# EAGLE design Shruti-FrontPanel-v03 (EAGLE 5.06)
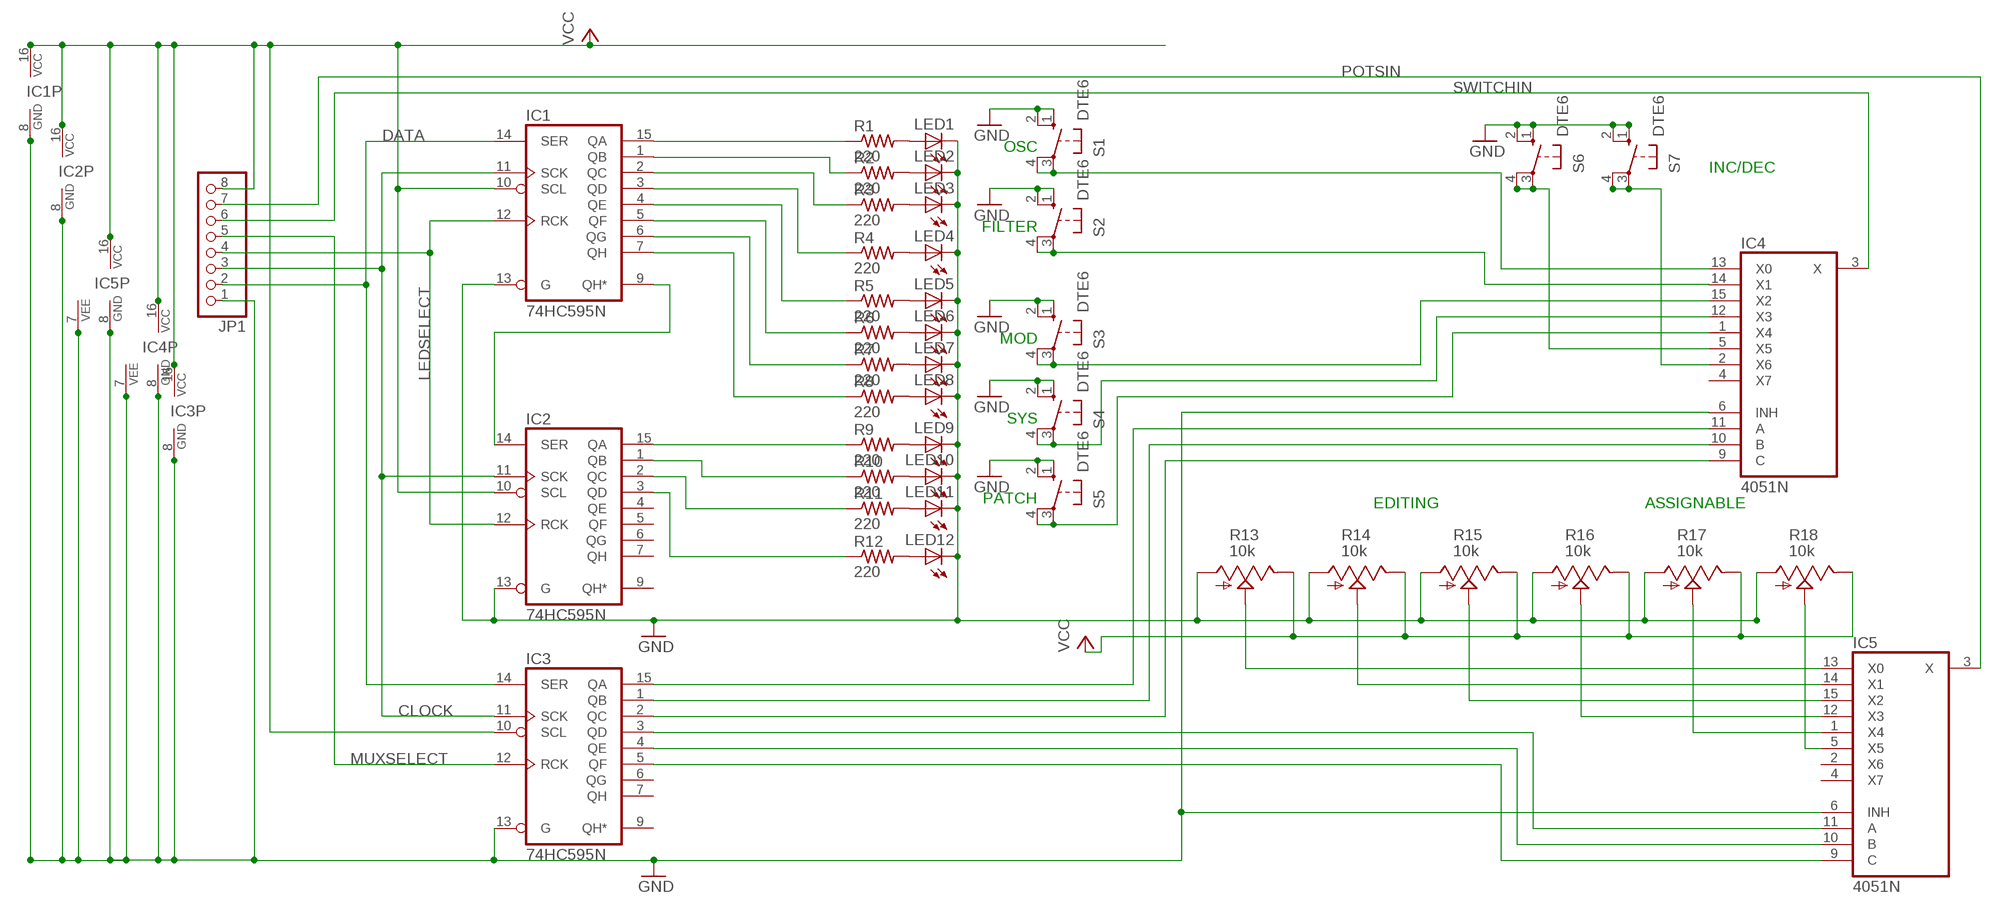
[diagram p0: schematic, sheet 1]

## Parts
IC1  74HC595N  [DIL16]
IC2  74HC595N  [DIL16]
IC3  74HC595N  [DIL16]
IC4  4051N  [DIL16]
IC5  4051N  [DIL16]
JP1  PINHD-1X8  [1X08]
LED1  LED3MM  [LED3MM]
LED2  LED3MM  [LED3MM]
LED3  LED3MM  [LED3MM]
LED4  LED3MM  [LED3MM]
LED5  LED3MM  [LED3MM]
LED6  LED3MM  [LED3MM]
LED7  LED3MM  [LED3MM]
LED8  LED3MM  [LED3MM]
LED9  LED3MM  [LED3MM]
LED10  LED3MM  [LED3MM]
LED11  LED3MM  [LED3MM]
LED12  LED3MM  [LED3MM]
R1  220  R-US_0204/7  [0204/7]
R2  220  R-US_0204/7  [0204/7]
R3  220  R-US_0204/7  [0204/7]
R4  220  R-US_0204/7  [0204/7]
R5  220  R-US_0204/7  [0204/7]
R6  220  R-US_0204/7  [0204/7]
R7  220  R-US_0204/7  [0204/7]
R8  220  R-US_0204/7  [0204/7]
R9  220  R-US_0204/7  [0204/7]
R10  220  R-US_0204/7  [0204/7]
R11  220  R-US_0204/7  [0204/7]
R12  220  R-US_0204/7  [0204/7]
R13  10k  POT_US  [ALPS_POT_SFE]
R14  10k  POT_US  [ALPS_POT_SFE]
R15  10k  POT_US  [ALPS_POT_SFE]
R16  10k  POT_US  [ALPS_POT_SFE]
R17  10k  POT_US  [ALPS_POT_SFE]
R18  10k  POT_US  [ALPS_POT_SFE]
S1  DTE6  40-XX  [B3F-40XX]
S2  DTE6  40-XX  [B3F-40XX]
S3  DTE6  40-XX  [B3F-40XX]
S4  DTE6  40-XX  [B3F-40XX]
S5  DTE6  40-XX  [B3F-40XX]
S6  DTE6  40-XX  [B3F-40XX]
S7  DTE6  40-XX  [B3F-40XX]

## Nets
CLOCK: IC1.11(SCK) IC2.11(SCK) IC3.11(SCK) JP1.3
DATA: IC1.14(SER) IC3.14(SER) JP1.2
GND: IC1.8(GND) IC1.13(G) IC2.8(GND) IC2.13(G) IC3.8(GND) IC3.13(G) IC4.6(INH) IC4.7(VEE) IC4.8(GND) IC5.6(INH) IC5.7(VEE) IC5.8(GND) JP1.1 LED1.K(C) LED2.K(C) LED3.K(C) LED4.K(C) LED5.K(C) LED6.K(C) LED7.K(C) LED8.K(C) LED9.K(C) LED10.K(C) LED11.K(C) LED12.K(C) R13.P$3(A) R14.P$3(A) R15.P$3(A) R16.P$3(A) R17.P$3(A) R18.P$3(A) S1.1(S) S1.2(S1) S2.1(S) S2.2(S1) S3.1(S) S3.2(S1) S4.1(S) S4.2(S1) S5.1(S) S5.2(S1) S6.1(S) S6.2(S1) S7.1(S) S7.2(S1)
LEDSELECT: IC1.12(RCK) IC2.12(RCK) JP1.4
MUXSELECT: IC3.12(RCK) JP1.5
N$1: IC1.9(QH*) IC2.14(SER)
N$2: LED1.A R1.2
N$3: LED2.A R2.2
N$4: LED3.A R3.2
N$5: LED4.A R4.2
N$6: LED5.A R5.2
N$7: LED6.A R6.2
N$8: LED7.A R7.2
N$9: LED9.A R9.2
N$10: LED10.A R10.2
N$11: LED11.A R11.2
N$12: LED12.A R12.2
N$13: IC1.15(QA) R1.1
N$14: IC1.1(QB) R2.1
N$15: IC1.2(QC) R3.1
N$16: IC1.3(QD) R4.1
N$17: IC1.4(QE) R5.1
N$18: IC1.5(QF) R6.1
N$19: IC1.6(QG) R7.1
N$20: IC1.7(QH) R8.1
N$21: LED8.A R8.2
N$22: IC2.15(QA) R9.1
N$23: IC2.1(QB) R10.1
N$24: IC2.2(QC) R11.1
N$25: IC3.15(QA) IC4.11(A)
N$26: IC3.1(QB) IC4.10(B)
N$27: IC2.3(QD) R12.1
N$28: IC5.1(X4) R17.P$2(S)
N$29: IC5.5(X5) R18.P$2(S)
N$31: IC3.2(QC) IC4.9(C)
N$32: IC3.3(QD) IC5.11(A)
N$33: IC3.4(QE) IC5.10(B)
N$34: IC3.5(QF) IC5.9(C)
N$35: IC5.13(X0) R13.P$2(S)
N$36: IC4.5(X5) S6.3(P) S6.4(P1)
N$37: IC5.14(X1) R14.P$2(S)
N$38: IC5.15(X2) R15.P$2(S)
N$39: IC5.12(X3) R16.P$2(S)
N$40: IC4.2(X6) S7.3(P) S7.4(P1)
N$41: IC4.13(X0) S1.3(P) S1.4(P1)
N$42: IC4.14(X1) S2.3(P) S2.4(P1)
N$43: IC4.15(X2) S3.3(P) S3.4(P1)
N$44: IC4.12(X3) S4.3(P) S4.4(P1)
N$45: IC4.1(X4) S5.3(P) S5.4(P1)
POTSIN: IC5.3(X) JP1.7
SWITCHIN: IC4.3(X) JP1.6
VCC: IC1.10(SCL) IC1.16(VCC) IC2.10(SCL) IC2.16(VCC) IC3.10(SCL) IC3.16(VCC) IC4.16(VCC) IC5.16(VCC) JP1.8 R13.P$1(E) R14.P$1(E) R15.P$1(E) R16.P$1(E) R17.P$1(E) R18.P$1(E)
Unconnected: IC2.4(QE) IC2.5(QF) IC2.6(QG) IC2.7(QH) IC2.9(QH*) IC3.6(QG) IC3.7(QH) IC3.9(QH*) IC4.4(X7) IC5.2(X6) IC5.4(X7)

## Notes on the sheet
- OSC
- INC/DEC
- FILTER
- MOD
- SYS
- PATCH
- EDITING | ASSIGNABLE

## Library data of the parts
IC1-IC3 = 74xx-eu:74*595: 8-bit SHIFT REGISTER, output latch
IC4 IC5 = 40xx:4051: 8-channel ANALOG MULTIPLEXER
JP1 = pinhead:PINHD-1X8: PIN HEADER
LED1-LED12 = led:LED: LED OSRAM: - CHIPLED LG R971, LG N971, LY N971, LG Q971, LY Q971, LO R971, LY R971 LH N974, LH R974 LS Q976, LO Q976, LY Q976 LO Q996 - Hyper CHIPLED LW Q18S LB Q993, LB Q99A, LB R99A - SideLED LS A670, LO A670, LY A670, LG A670, LP A670 LB A673, LV A673, LT A673, LW A673 LH A674 LY A675 LS A676, LA A676, LO A676, LY A676, LW A676 LS A679, LY A679, LG A679 - Hyper Micro SIDELED® LS Y876, LA Y876, LO Y876, LY Y876 LT Y87S - SmartLED LW L88C, LW L88S LB L89C, LB L89S, LG L890 LS L89K, LO L89K, LY L89K LS L896, LA L896, LO L896, LY L896 - TOPLED LS T670, LO T670, LY T670, LG T670, LP T670 LSG T670, LSP T670, LSY T670, LOP T670, LYG T670 LG T671, LOG T671, LSG T671 LB T673, LV T673, LT T673, LW T673 LH T674 LS T676, LA T676, LO T676, LY T676, LB T676, LH T676, LSB T676, LW T676 LB T67C, LV T67C, LT T67C, LS T67K, LO T67K, LY T67K, LW E67C LS E67B, LA E67B, LO E67B, LY E67B, LB E67C, LV E67C, LT E67C LW T67C LS T679, LY T679, LG T679 LS T770, LO T770, LY T770, LG T770, LP T770 LB T773, LV T773, LT T773, LW T773 LH T774 LS E675, LA E675, LY E675, LS T675 LS T776, LA T776, LO T776, LY T776, LB T776 LHGB T686 LT T68C, LB T68C - Hyper Mini TOPLED® LB M676 - Mini TOPLED Santana® LG M470 LS M47K, LO M47K, LY M47K Source: http://www.osram.convergy.de LUXEON: - LUMILED® LXK2-PW12-R00, LXK2-PW12-S00, LXK2-PW14-U00, LXK2-PW14-V00 LXK2-PM12-R00, LXK2-PM12-S00, LXK2-PM14-U00 LXK2-PE12-Q00, LXK2-PE12-R00, LXK2-PE12-S00, LXK2-PE14-T00, LXK2-PE14-U00 LXK2-PB12-K00, LXK2-PB12-L00, LXK2-PB12-M00, LXK2-PB14-N00, LXK2-PB14-P00, LXK2-PB14-Q00 LXK2-PR12-L00, LXK2-PR12-M00, LXK2-PR14-Q00, LXK2-PR14-R00 LXK2-PD12-Q00, LXK2-PD12-R00, LXK2-PD12-S00 LXK2-PH12-R00, LXK2-PH12-S00 LXK2-PL12-P00, LXK2-PL12-Q00, LXK2-PL12-R00 Source: www.luxeon.com KINGBRIGHT: KA-3528ASYC Source: www.kingbright.com
R1-R12 = resistor:R-US_: RESISTOR, American symbol
R13-R18 = pot-alps:POT_US
S1-S7 = switch-omron:40-XX: OMRON SWITCH

## Board
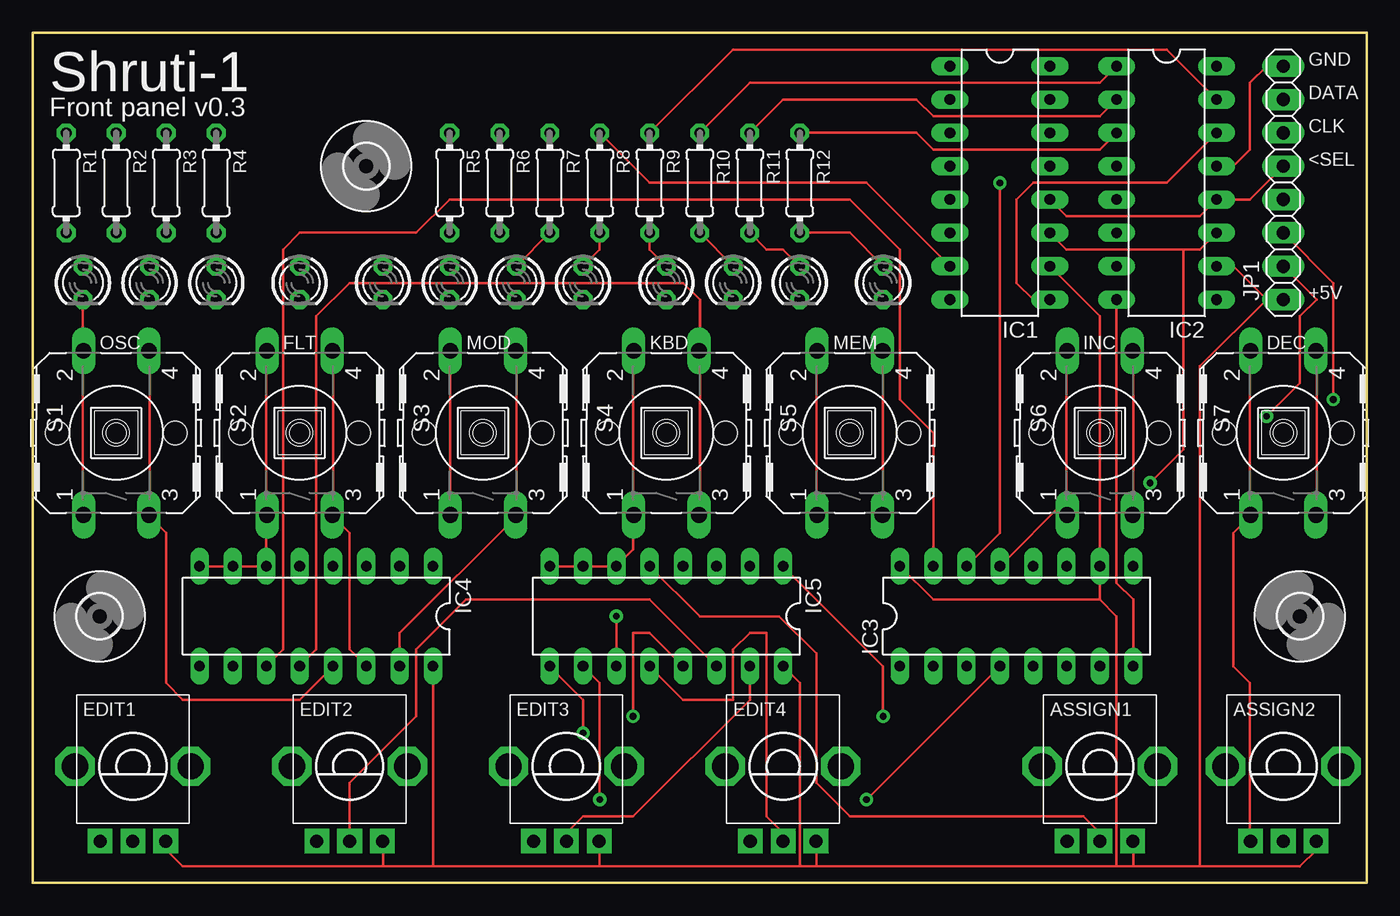
[diagram p1: board, top side]
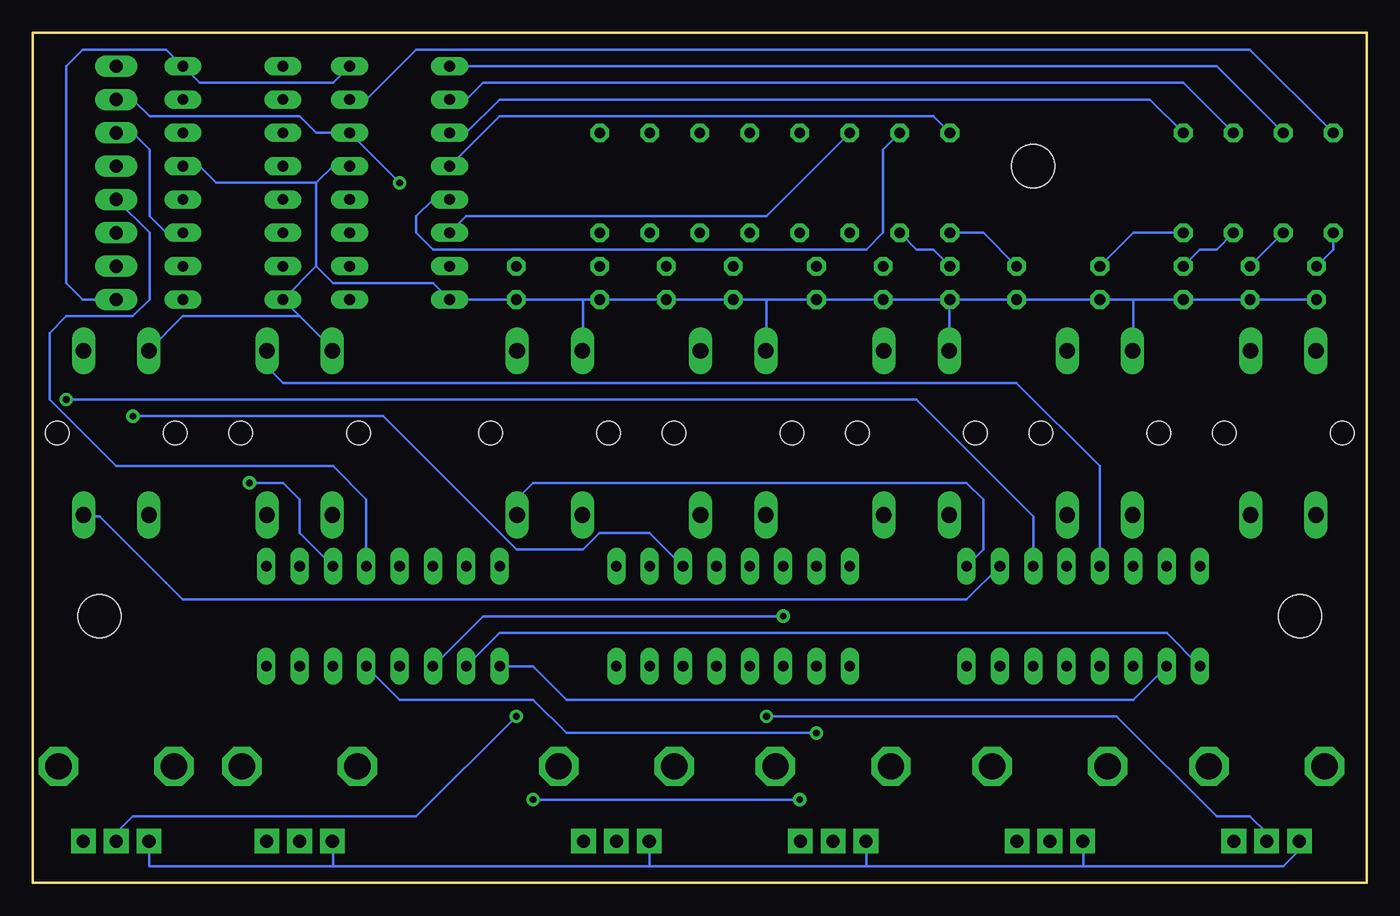
[diagram p2: board, bottom side, seen from below]

Size 101.6 x 64.77 mm. Coordinates in mm from the lower left corner, seen from the top.
Outline: 0,64.76 101.6,64.76 101.6,0 0,0 0,64.76
Outline: 0,64.77 0,64.76
Copper layers (1*16): Top 0.035mm / dielectric 1.5mm / Bottom 0.035mm
Design rules "SparkFun": minimum track width 8mil, minimum drill 20mil, track to track 8mil, track to pad 8mil, pad to pad 8mil, via to via 8mil, smd to smd 8mil, copper to edge 10mil, drill to drill 8mil, minimum pad ring 12mil, minimum via ring 10mil, stop-mask expansion 4mil, vias tented up to drill 25mil, thermal gap 10mil

### Footprints (pad centres in the part's own frame; a part is rotated, then mirrored left to right if it is on the bottom)
DIL16 = drill 0.813 long: 1 -8.89,-3.81; 2 -6.35,-3.81; 3 -3.81,-3.81; 4 -1.27,-3.81; 5 1.27,-3.81; 6 3.81,-3.81; 7 6.35,-3.81; 8 8.89,-3.81; 9 8.89,3.81; 10 6.35,3.81; 11 3.81,3.81; 12 1.27,3.81; 13 -1.27,3.81; 14 -3.81,3.81; 15 -6.35,3.81; 16 -8.89,3.81
1X08 = drill 1.016 long: 1 -8.89,0; 2 -6.35,0; 3 -3.81,0; 4 -1.27,0; 5 1.27,0; 6 3.81,0; 7 6.35,0; 8 8.89,0
LED3MM = drill 0.813 octagon: A -1.27,0; K 1.27,0
0204/7 = drill 0.813 octagon: 1 -3.81,0; 2 3.81,0
ALPS_POT_SFE = drill 1 pad 1.88 square: P$1 -2.5,5.7; P$2 0,5.7; P$3 2.5,5.7 | drill 2 octagon: P$4 -4.4,0; P$5 4.4,0
B3F-40XX = drill 1.194 long: 1 -6.248,2.489; 2 6.248,2.489; 3 -6.248,-2.489; 4 6.248,-2.489 | hole 1.803: 0,-4.496; 0,4.496
3,3 = hole 3.3: 0,0

### Placement (x,y rotation side)
IC1  73.66,53.34 270 top
IC2  86.36,53.34 270 top
IC3  74.93,20.32 0 top
IC4  21.59,20.32 180 top
IC5  48.26,20.32 180 top
JP1  95.25,53.34 270 top
LED1  3.81,45.72 270 top
LED2  8.89,45.72 270 top
LED3  13.97,45.72 270 top
LED4  20.32,45.72 270 top
LED5  26.67,45.72 270 top
LED6  31.75,45.72 270 top
LED7  36.83,45.72 270 top
LED8  41.91,45.72 270 top
LED9  48.26,45.72 270 top
LED10  53.34,45.72 270 top
LED11  58.42,45.72 270 top
LED12  64.77,45.72 270 top
R1  2.54,53.34 270 top
R2  6.35,53.34 270 top
R3  10.16,53.34 270 top
R4  13.97,53.34 270 top
R5  31.75,53.34 270 top
R6  35.56,53.34 270 top
R7  39.37,53.34 270 top
R8  43.18,53.34 270 top
R9  46.99,53.34 270 top
R10  50.8,53.34 270 top
R11  54.61,53.34 270 top
R12  58.42,53.34 270 top
R13  7.62,8.89 180 top
R14  24.13,8.89 180 top
R15  40.64,8.89 180 top
R16  57.15,8.89 180 top
R17  95.25,8.89 180 top
R18  81.28,8.89 180 top
S1  6.35,34.29 90 top
S2  20.32,34.29 90 top
S3  34.29,34.29 90 top
S4  48.26,34.29 90 top
S5  62.23,34.29 90 top
S6  81.28,34.29 90 top
S7  95.25,34.29 90 top
U$1  [3,3]  5.08,20.32 0 top
U$2  [3,3]  96.52,20.32 90 top
U$3  [3,3]  25.4,54.61 0 top

### Tracks (layer width: path | path; a pad name or v marks a point on that pad's centre or on a via)
CLOCK  (via drill 0.51)
  Top 0.203: 87.63,48.26 88.9,48.26 IC2.11 | 87.63,48.26 78.74,48.26 IC1.11 | v85.09,30.48 87.63,33.02 87.63,48.26
  Bottom 0.203: JP1.3 93.98,57.15 92.71,55.88 92.71,50.8 91.44,49.53 IC2.11 | IC3.11 81.28,26.67 81.28,29.21 82.55,30.48 v85.09,30.48
DATA  (via drill 0.51)
  Top 0.203: IC3.14 73.66,26.67 v73.66,53.34
  Bottom 0.203: JP1.2 93.98,59.69 92.71,58.42 81.28,58.42 80.01,57.15 IC1.14 v73.66,53.34
GND
  Top 0.203: S7.2 92.71,39.37 92.71,29.21 S7.1 92.71,27.94 91.44,26.67 91.44,16.51 92.71,15.24 92.71,3.81 R17.P$3 | S5.1 59.69,29.21 59.69,39.37 S5.2 | S1.1 3.81,29.21 3.81,39.37 S1.2 3.81,40.64 LED1.K | 78.74,29.21 78.74,39.37 S6.2 | S4.2 45.72,39.37 45.72,29.21 S4.1 45.72,27.94 45.72,25.4 IC5.6 IC5.7 IC5.8 | S2.2 17.78,39.37 17.78,29.21 S2.1 17.78,27.94 IC4.6 IC4.7 IC4.8 | 78.74,29.21 IC3.13 | 78.74,29.21 S6.1 | IC3.8 83.82,21.59 82.55,22.86 IC2.8 | IC2.13 91.44,54.61 92.71,55.88 92.71,60.96 93.98,62.23 JP1.1 | S3.2 S3.1
  Bottom 0.203: LED6.K LED5.K LED4.K 17.78,44.45 | LED6.K 31.8,44.4 S3.2 | LED6.K LED7.K LED8.K 45.72,44.45 | 3.86,44.4 LED1.K LED2.K LED3.K 17.78,44.45 | 80.01,46.99 IC2.8 81.28,43.18 | 80.01,46.99 80.01,53.34 | 80.01,53.34 78.74,54.61 IC1.13 | IC2.13 88.9,54.61 87.63,53.34 80.01,53.34 | 45.72,44.45 LED9.K LED10.K LED11.K 59.69,44.45 | 59.69,44.45 LED12.K IC1.8 71.12,45.72 78.74,45.72 80.01,46.99 | 17.78,44.45 17.83,44.45 | 45.72,44.45 45.77,44.45 | 59.69,44.45 59.74,44.45 | 17.78,44.45 17.78,40.64 S2.2 | 45.72,44.45 45.72,40.64 S4.2 | 59.69,44.45 59.69,40.64 S5.2 | S7.1 92.71,27.94 | S6.1 78.74,27.94 | R13.P$3 5.08,3.15 5.08,2.54 6.35,1.27 21.59,1.27 | 21.59,1.27 38.1,1.27 | 38.1,1.27 54.61,1.27 | 54.61,1.27 78.74,1.27 | 78.74,1.27 92.71,1.27 92.75,1.31 R17.P$3 | R18.P$3 78.74,3.15 78.74,1.27 | R16.P$3 54.61,3.15 54.61,1.27 | R15.P$3 38.1,3.15 38.1,1.27 | R14.P$3 21.59,3.15 21.59,1.27 | 81.28,43.18 78.74,40.64 S6.2 | 81.28,43.18 90.17,43.18 92.71,40.64 S7.2
LEDSELECT
  Top 0.203: IC1.12 78.74,50.8 88.9,50.8 IC2.12 92.71,52.07 JP1.4
MUXSELECT
  Bottom 0.203: IC3.12 76.2,29.21 78.74,31.75 95.25,31.75 100.33,36.83 100.33,41.91 99.06,43.18 93.98,43.18 92.71,44.45 92.71,49.53 JP1.5
N$1
  Top 0.203: IC1.9 76.2,44.45 74.93,45.72 74.93,52.07 76.2,53.34 86.36,53.34 IC2.14
N$2
  Bottom 0.203: R1.2 2.54,48.26 LED1.A
N$3
  Bottom 0.203: R2.2 LED2.A
N$4
  Bottom 0.203: R3.2 11.43,48.26 12.7,48.26 LED3.A
N$5
  Bottom 0.203: R4.2 17.78,49.53 LED4.A
N$6
  Bottom 0.203: R5.2 29.21,49.53 LED5.A
N$7
  Bottom 0.203: LED6.A 33.02,48.26 34.29,48.26 R6.2
N$8
  Top 0.203: LED7.A R7.2
N$9
  Top 0.203: R9.2 46.99,48.26 LED9.A
N$10
  Top 0.203: R10.2 LED10.A
N$11
  Top 0.203: R11.2 55.88,48.26 57.15,48.26 LED11.A
N$12
  Top 0.203: R12.2 62.23,49.53 LED12.A
N$13
  Bottom 0.203: IC1.15 76.2,59.69 72.39,63.5 8.89,63.5 R1.1
N$14
  Bottom 0.203: IC1.1 11.43,62.23 R2.1
N$15
  Bottom 0.203: IC1.2 68.58,59.69 67.31,60.96 13.97,60.96 R3.1
N$16
  Bottom 0.203: IC1.3 68.58,57.15 66.04,59.69 16.51,59.69 R4.1
N$17
  Bottom 0.203: R5.1 33.02,58.42 66.04,58.42 IC1.4
N$18
  Bottom 0.203: R6.1 36.83,55.88 36.83,49.53 38.1,48.26 71.12,48.26 72.39,49.53 72.39,50.8 71.12,52.07 IC1.5
N$19
  Bottom 0.203: IC1.6 68.58,50.8 45.72,50.8 R7.1
N$20
  Top 0.203: IC1.7 63.5,53.34 46.99,53.34 R8.1
N$21
  Top 0.203: LED8.A 43.18,48.26 R8.2
N$22
  Top 0.203: R9.1 53.34,63.5 86.36,63.5 IC2.15
N$23
  Top 0.203: R10.1 54.61,60.96 81.28,60.96 IC2.1
N$24
  Top 0.203: R11.1 57.15,59.69 67.31,59.69 68.58,58.42 81.28,58.42 IC2.2
N$25
  Top 0.203: IC4.11 19.05,17.78 19.05,48.26 20.32,49.53 29.21,49.53 31.75,52.07 62.23,52.07 66.04,48.26 66.04,36.83 68.58,34.29 IC3.15
N$26
  Bottom 0.203: IC4.10 17.78,13.97 60.96,13.97 63.5,16.51 IC3.1
N$27
  Top 0.203: R12.1 67.31,57.15 68.58,55.88 81.28,55.88 IC2.3
N$28  (via drill 0.51)
  Top 0.203: IC5.1 64.77,16.51 v64.77,12.7
  Bottom 0.203: v64.77,12.7 72.39,5.08 93.98,5.08 95.25,3.81 R17.P$2
N$29
  Top 0.203: IC5.5 50.8,20.32 56.85,20.32 59.69,17.48 59.69,7.62 62.23,5.08 80.01,5.08 81.28,3.81 R18.P$2
N$31
  Bottom 0.203: IC4.9 15.24,19.05 66.04,19.05 IC3.2
N$32  (via drill 0.51)
  Top 0.203: IC5.11 v44.45,20.32
  Bottom 0.203: v44.45,20.32 67.31,20.32 IC3.3
N$33  (via drill 0.51)
  Top 0.203: IC5.10 43.18,15.24 v43.18,6.35 | v63.5,6.35 IC3.4
  Bottom 0.203: v43.18,6.35 v63.5,6.35
N$34  (via drill 0.51)
  Top 0.203: IC5.9 41.91,13.97 v41.91,11.43
  Bottom 0.203: v41.91,11.43 60.96,11.43 63.5,13.97 73.66,13.97 IC3.5
N$35  (via drill 0.51)
  Top 0.203: IC5.13 46.99,19.05 45.72,19.05 v45.72,12.7
  Bottom 0.203: v45.72,12.7 19.05,12.7 11.43,5.08 8.89,5.08 7.62,3.81 R13.P$2
N$36
  Top 0.203: S6.3 83.82,29.21 83.82,39.37 S6.4
  Bottom 0.203: IC4.5 20.32,31.75 26.67,38.1 82.55,38.1 83.82,39.37 S6.4
N$37
  Top 0.203: IC5.14 46.99,21.59 33.02,21.59 29.21,17.78 29.21,12.7 24.13,7.62 R14.P$2
N$38
  Top 0.203: IC5.15 54.61,13.97 45.72,5.08 41.91,5.08 40.64,3.81 R15.P$2
N$39
  Top 0.203: IC5.12 49.53,13.97 53.34,13.97 53.34,17.78 54.61,19.05 55.88,19.05 55.88,5.08 57.15,3.81 R16.P$2
N$40
  Top 0.203: S7.4 97.79,39.37 97.79,29.21 S7.3
  Bottom 0.203: IC4.2 30.48,21.59 90.17,21.59 91.44,22.86 96.52,27.94 97.79,27.94 S7.3
N$41
  Top 0.203: S1.4 8.89,39.37 8.89,29.21 S1.3 8.89,27.94 10.16,26.67 10.16,15.24 11.43,13.97 20.32,13.97 IC4.13
N$42
  Top 0.203: S2.4 22.86,39.37 22.86,29.21 S2.3 22.86,27.94 24.13,26.67 24.13,17.78 IC4.14
N$43
  Top 0.203: S3.4 36.83,39.37 36.83,29.21 S3.3 36.83,27.94 27.94,19.05 IC4.15
N$44
  Top 0.203: S4.3 50.8,29.21 50.8,39.37 S4.4 50.8,40.64 50.8,44.45 49.53,45.72 24.13,45.72 21.59,43.18 21.59,17.78 IC4.12
N$45
  Top 0.203: S5.4 64.77,39.37 64.77,29.21 S5.3
  Bottom 0.203: 64.77,27.94 S5.3 64.77,29.21 63.5,30.48 30.48,30.48 29.21,29.21 29.21,25.4 IC4.1
POTSIN  (via drill 0.51)
  Top 0.203: v93.98,35.56 96.52,38.1 96.52,43.18 97.79,44.45 JP1.7
  Bottom 0.203: IC5.3 54.61,26.67 58.42,26.67 59.69,25.4 64.77,25.4 74.93,35.56 v93.98,35.56
SWITCHIN  (via drill 0.51)
  Top 0.203: v99.06,36.83 99.06,45.72 JP1.6
  Bottom 0.203: IC4.3 25.4,27.94 34.29,36.83 v99.06,36.83
VCC
  Top 0.203: 93.98,44.45 91.44,46.99 IC2.10 | R13.P$1 10.16,3.15 10.16,2.54 11.43,1.27 26.67,1.27 | 26.67,1.27 30.48,1.27 | 30.48,1.27 43.18,1.27 | 43.18,1.27 58.42,1.27 | 58.42,1.27 59.69,1.27 | 59.69,1.27 82.55,1.27 | 82.55,1.27 83.82,1.27 | 83.82,1.27 88.9,1.27 | 88.9,1.27 96.52,1.27 97.79,2.54 R17.P$1 | R18.P$1 83.82,3.15 83.82,1.27 | R16.P$1 59.69,3.15 59.69,1.27 | R15.P$1 43.18,3.15 43.18,1.27 | R14.P$1 26.67,3.15 26.67,1.27 | IC3.16 68.58,21.59 81.28,21.59 | 81.28,21.59 IC3.10 81.28,43.18 IC1.10 | 30.48,1.27 IC4.16 | IC5.16 58.42,15.24 58.42,1.27 | 93.98,44.45 88.9,39.37 88.9,1.27 | 93.98,44.45 JP1.8 | 81.28,21.59 82.55,20.32 82.55,1.27
  Bottom 0.203: IC1.16 78.74,60.96 88.9,60.96 IC2.16 91.44,63.5 97.79,63.5 99.06,62.23 99.06,45.72 97.79,44.45 JP1.8

### Text on the board
tPlace: GND | Shruti-1 | DATA | CLK | <SEL | +5V
tNames: Front panel v0.3 | OSC | FLT | MOD | KBD | MEM | INC | DEC | EDIT1 | EDIT2 | EDIT3 | EDIT4 | ASSIGN1 | ASSIGN2
License: cc-by-nc-sa 3.0 | ol.gillet@gmail.com